# EAGLE schematic ActuatorBoard (EAGLE 9.6.2)
DESIGNER: Thomas Christison, James Smith; REV#: B; REVIEWER: ADCS Electrical

## Sheet 1 of 6
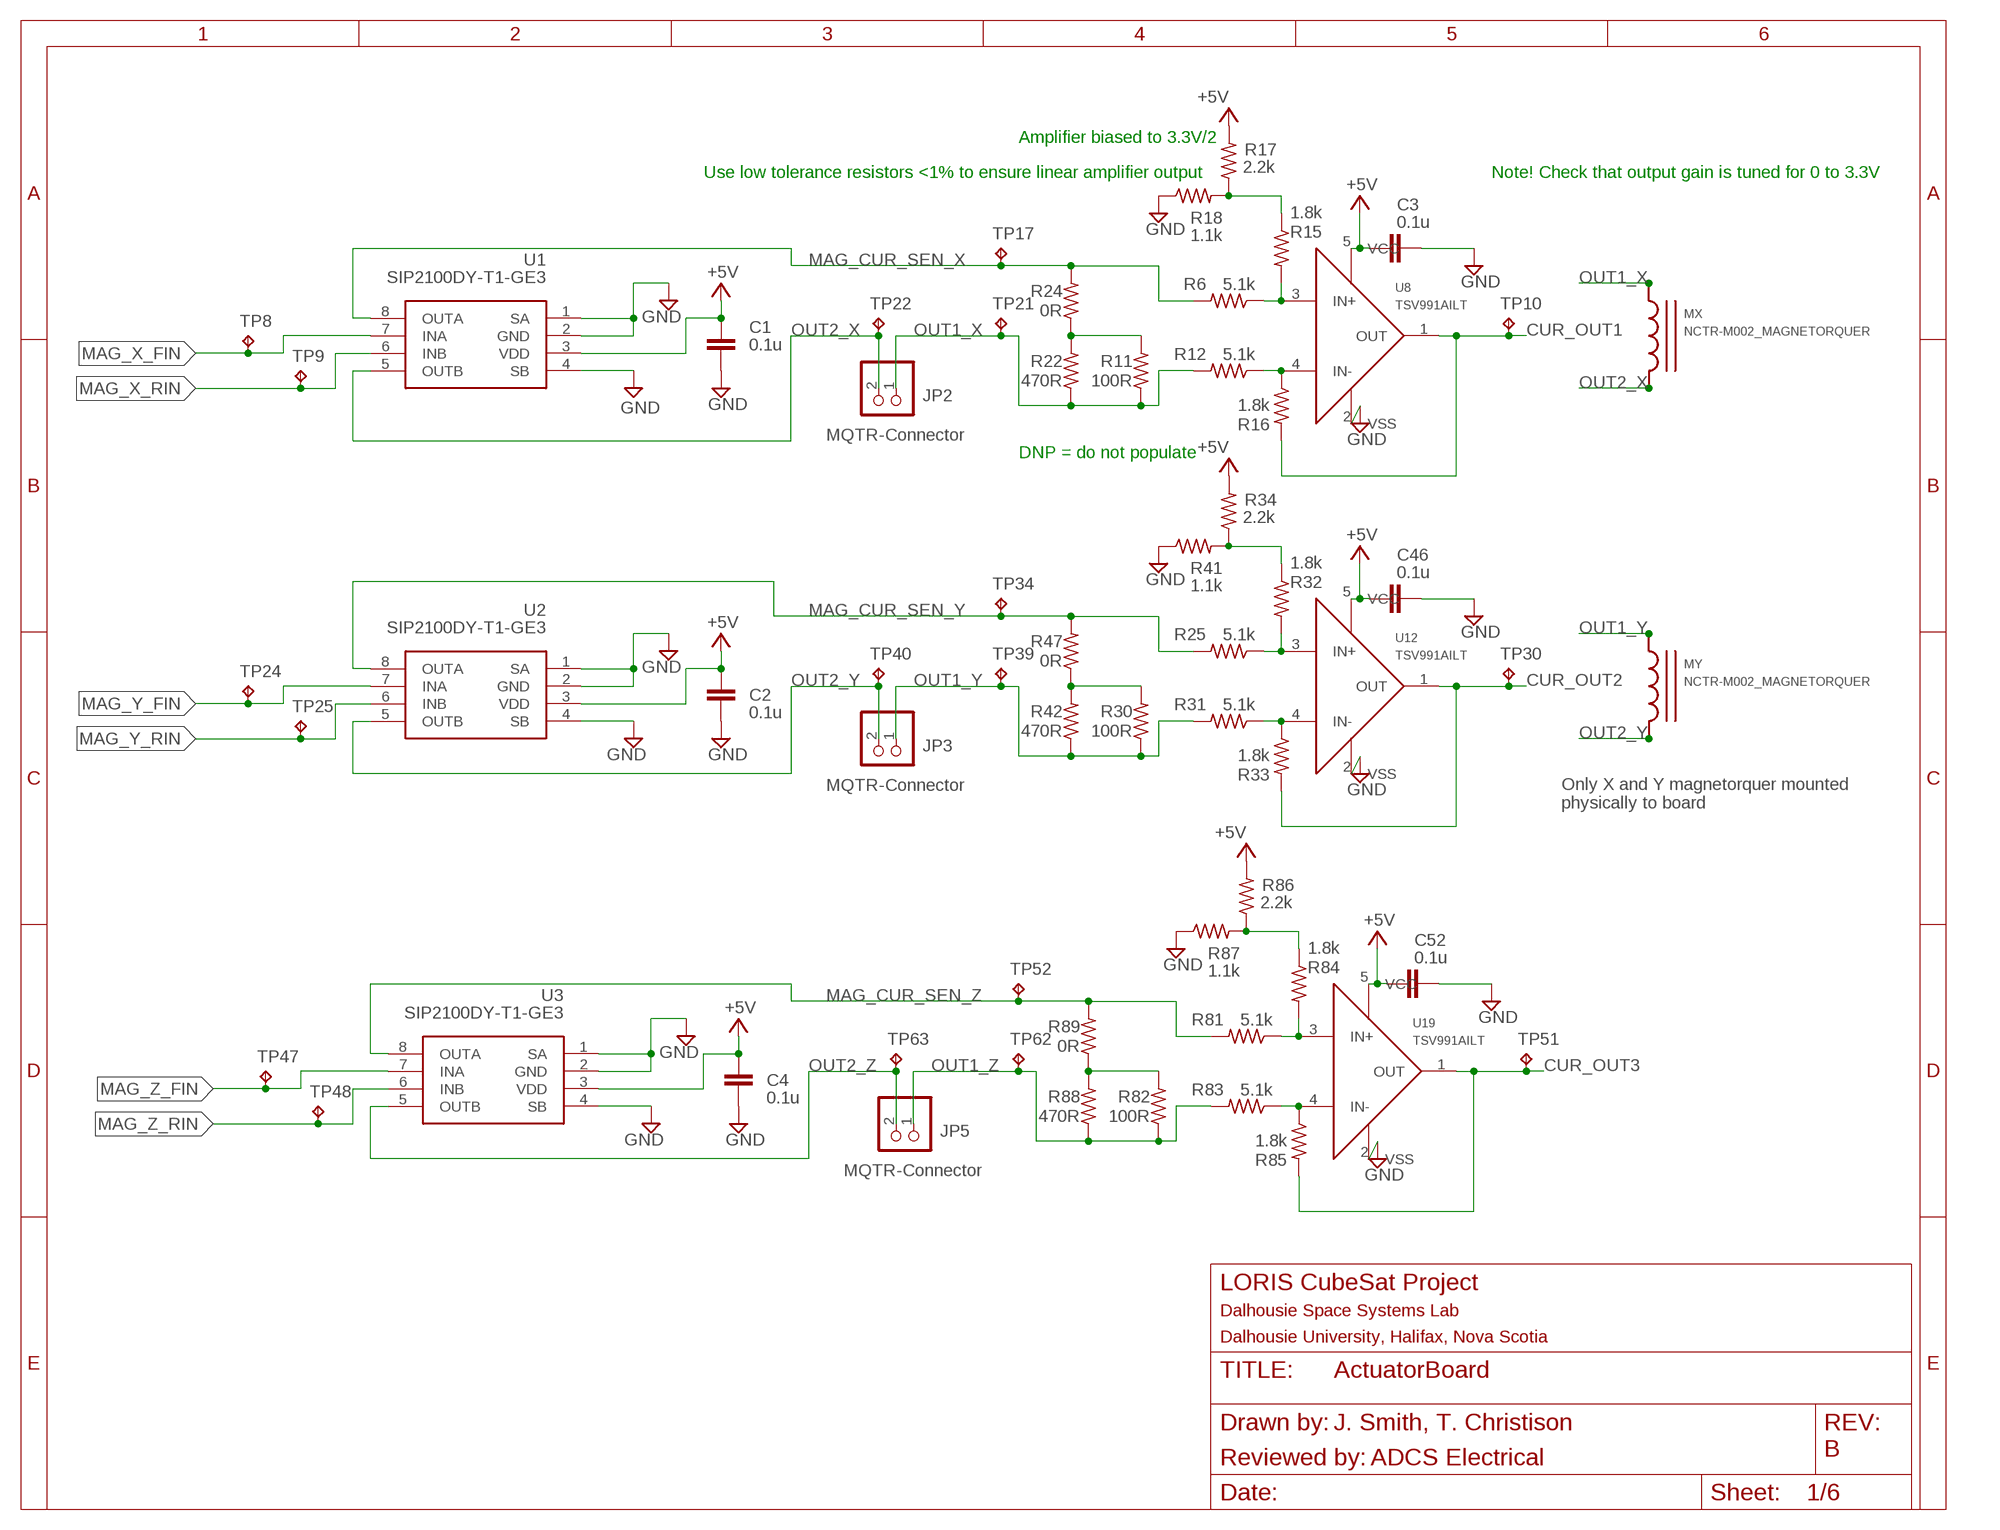
[diagram p0: schematic, sheet 1]

### Parts
C1  0.1u  C-EUC0603  [C0603]
C2  0.1u  C-EUC0603  [C0603]
C3  0.1u  C-EUC0402  [C0402]
C4  0.1u  C-EUC0603  [C0603]
C46  0.1u  C-EUC0402  [C0402]
C52  0.1u  C-EUC0402  [C0402]
JP2  PINHD-1X2  [1X02]
JP3  PINHD-1X2  [1X02]
JP5  PINHD-1X2  [1X02]
MX  NCTR-M002_MAGNETORQUER  [MAG_MOUNT_V3]
MY  NCTR-M002_MAGNETORQUER  [MAG_MOUNT_V3]
R6  5.1k  R-US_R0402  [R0402]
R11  100R  R-US_R0805  [R0805]
R12  5.1k  R-US_R0402  [R0402]
R15  1.8k  R-US_R0402  [R0402]
R16  1.8k  R-US_R0402  [R0402]
R17  2.2k  R-US_R0402  [R0402]
R18  1.1k  R-US_R0402  [R0402]
R22  470R  R-US_R0805  [R0805]
R24  0R  R-US_R0805  [R0805]
R25  5.1k  R-US_R0402  [R0402]
R30  100R  R-US_R0805  [R0805]
R31  5.1k  R-US_R0402  [R0402]
R32  1.8k  R-US_R0402  [R0402]
R33  1.8k  R-US_R0402  [R0402]
R34  2.2k  R-US_R0402  [R0402]
R41  1.1k  R-US_R0402  [R0402]
R42  470R  R-US_R0805  [R0805]
R47  0R  R-US_R0805  [R0805]
R81  5.1k  R-US_R0402  [R0402]
R82  100R  R-US_R0805  [R0805]
R83  5.1k  R-US_R0402  [R0402]
R84  1.8k  R-US_R0402  [R0402]
R85  1.8k  R-US_R0402  [R0402]
R86  2.2k  R-US_R0402  [R0402]
R87  1.1k  R-US_R0402  [R0402]
R88  470R  R-US_R0805  [R0805]
R89  0R  R-US_R0805  [R0805]
TP8  TESTPOINT  [TP_P76H50]
TP9  TESTPOINT  [TP_P76H50]
TP10  TESTPOINT  [TP_P76H50]
TP17  TESTPOINT  [TP_P76H50]
TP21  TESTPOINT  [TP_P76H50]
TP22  TESTPOINT  [TP_P76H50]
TP24  TESTPOINT  [TP_P76H50]
TP25  TESTPOINT  [TP_P76H50]
TP30  TESTPOINT  [TP_P76H50]
TP34  TESTPOINT  [TP_P76H50]
TP39  TESTPOINT  [TP_P76H50]
TP40  TESTPOINT  [TP_P76H50]
TP47  TESTPOINT  [TP_P76H50]
TP48  TESTPOINT  [TP_P76H50]
TP51  TESTPOINT  [TP_P76H50]
TP52  TESTPOINT  [TP_P76H50]
TP62  TESTPOINT  [TP_P76H50]
TP63  TESTPOINT  [TP_P76H50]
U1  SIP2100DY-T1-GE3  [SOIC8P127_490X600X175L71X43N_SIP2100DY-T1-GE3]
U2  SIP2100DY-T1-GE3  [SOIC8P127_490X600X175L71X43N_SIP2100DY-T1-GE3]
U3  SIP2100DY-T1-GE3  [SOIC8P127_490X600X175L71X43N_SIP2100DY-T1-GE3]
U8  TSV991AILT  [SOT95P280X145-5N]
U12  TSV991AILT  [SOT95P280X145-5N]
U19  TSV991AILT  [SOT95P280X145-5N]

### Nets
+5V: C1.1 C2.2 C3.1 C4.2 C46.1 C52.1 R17.2 R34.2 R86.2 U1.3(VDD) U2.3(VDD) U3.3(VDD) U8.5(VCC) U12.5(VCC) U19.5(VCC) ; also sheet 2,3,4,5
CUR_OUT1: R16.2 TP10.1(TP) U8.1(OUT) ; also sheet 2
CUR_OUT2: R33.2 TP30.1(TP) U12.1(OUT) ; also sheet 2
CUR_OUT3: R85.2 TP51.1(TP) U19.1(OUT) ; also sheet 2
GND: C1.2 C2.1 C3.2 C4.1 C46.2 C52.2 R18.1 R41.1 R87.1 U1.1(SA) U1.2(GND) U1.4(SB) U2.1(SA) U2.2(GND) U2.4(SB) U3.1(SA) U3.2(GND) U3.4(SB) U8.2(VSS) U12.2(VSS) U19.2(VSS) ; also sheet 2,3,4,5,6
MAG_CUR_SEN_X: R6.2 R24.2 TP17.1(TP) U1.8(OUTA)
MAG_CUR_SEN_Y: R25.2 R47.2 TP34.1(TP) U2.8(OUTA)
MAG_CUR_SEN_Z: R81.2 R89.2 TP52.1(TP) U3.8(OUTA)
MAG_X_FIN: TP8.1(TP) U1.7(INA) ; also sheet 2
MAG_X_RIN: TP9.1(TP) U1.6(INB) ; also sheet 2
MAG_Y_FIN: TP24.1(TP) U2.7(INA) ; also sheet 2
MAG_Y_RIN: TP25.1(TP) U2.6(INB) ; also sheet 2
MAG_Z_FIN: TP47.1(TP) U3.7(INA) ; also sheet 2
MAG_Z_RIN: TP48.1(TP) U3.6(INB) ; also sheet 2
N$6: R12.1 R16.1 U8.4(IN-)
N$8: R6.1 R15.2 U8.3(IN+)
N$9: R15.1 R17.1 R18.2
N$16: R11.2 R22.2 R24.1
N$17: R31.1 R33.1 U12.4(IN-)
N$20: R25.1 R32.2 U12.3(IN+)
N$21: R32.1 R34.1 R41.2
N$22: R30.2 R42.2 R47.1
N$48: R83.1 R85.1 U19.4(IN-)
N$53: R81.1 R84.2 U19.3(IN+)
N$54: R84.1 R86.1 R87.2
N$55: R82.2 R88.2 R89.1
OUT1_X: JP2.1 R11.1 R12.2 R22.1 TP21.1(TP)
OUT1_Y: JP3.1 R30.1 R31.2 R42.1 TP39.1(TP)
OUT1_Z: JP5.1 R82.1 R83.2 R88.1 TP62.1(TP)
OUT2_X: JP2.2 TP22.1(TP) U1.5(OUTB)
OUT2_Y: JP3.2 TP40.1(TP) U2.5(OUTB)
OUT2_Z: JP5.2 TP63.1(TP) U3.5(OUTB)

### Notes on the sheet
- Amplifier biased to 3.3V/2
- Use low tolerance resistors <1% to ensure linear amplifier output | Note! Check that output gain is tuned for 0 to 3.3V
- MQTR-Connector
- DNP = do not populate
- MQTR-Connector
- Only X and Y magnetorquer mounted
  physically to board
- MQTR-Connector
- J. Smith, T. Christison
- B
- ADCS Electrical

## Sheet 2 of 6
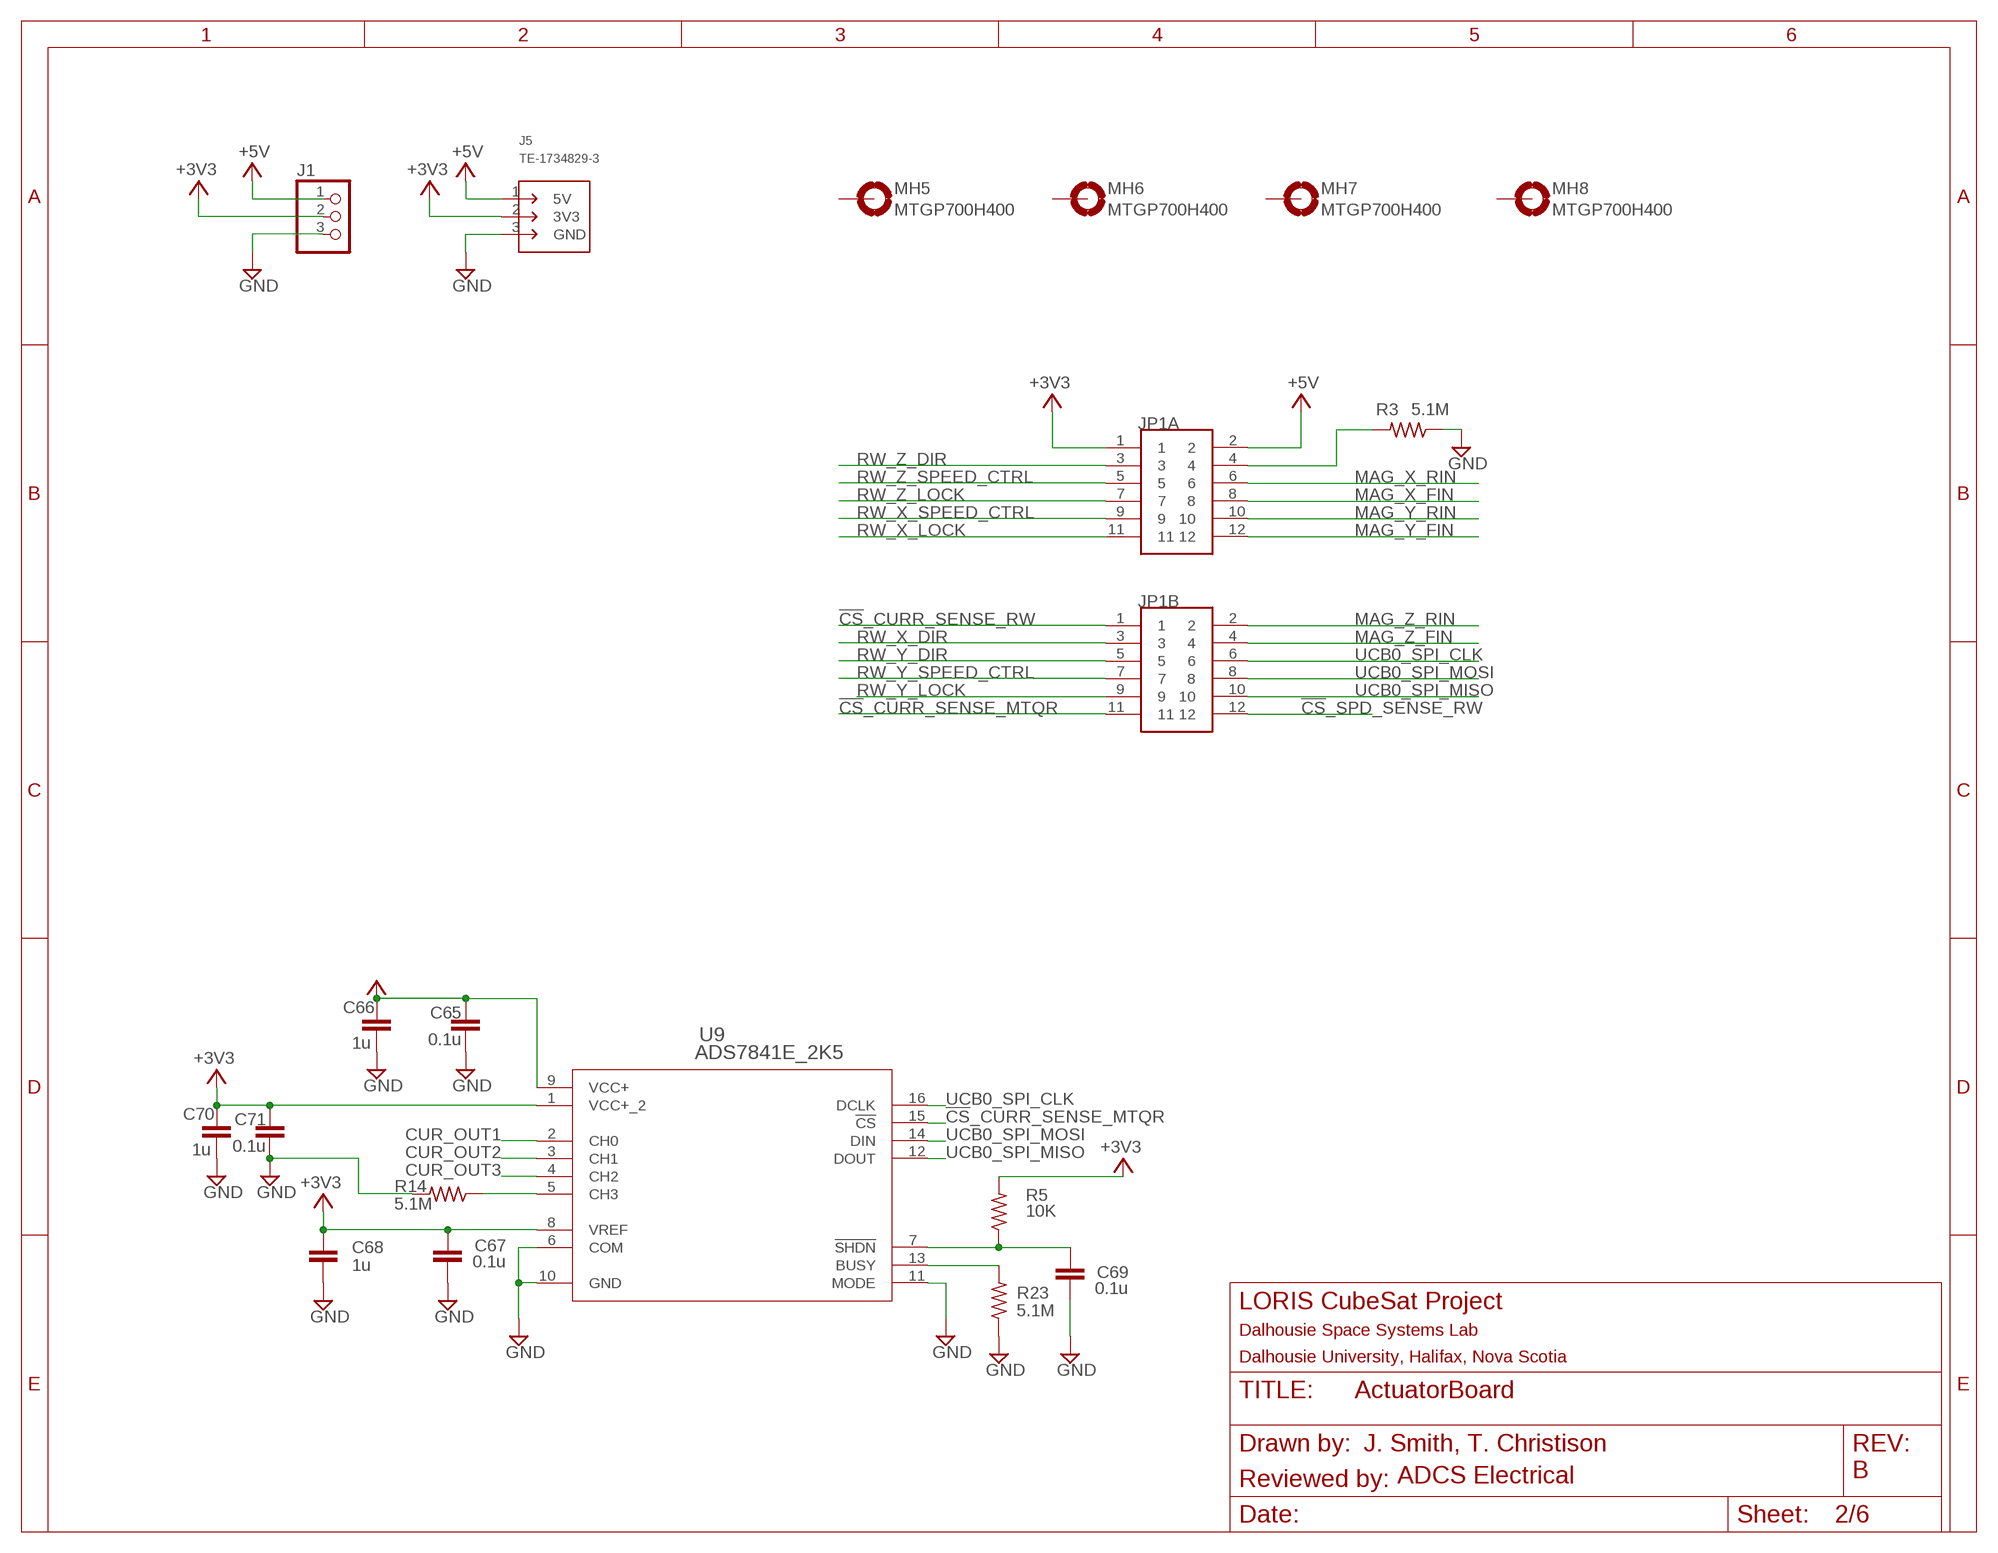
[diagram p1: schematic, sheet 2]

### Parts
C65  0.1u  C-EUC0402  [C0402]
C66  1u  C-EUC0402  [C0402]
C67  0.1u  C-EUC0402  [C0402]
C68  1u  C-EUC0402  [C0402]
C69  0.1u  C-EUC0402  [C0402]
C70  1u  C-EUC0402  [C0402]
C71  0.1u  C-EUC0402  [C0402]
J1  PINHD-1X3  [1X03]
J5  TE-1734829-3  [TE-1734829-3]
JP1A  832-10-012-10-005000  [832-10-012-10-005000]
JP1B  832-10-012-10-005000  [832-10-012-10-005000]
MH5  MTGP700H400  [MTGP700H400]
MH6  MTGP700H400  [MTGP700H400]
MH7  MTGP700H400  [MTGP700H400]
MH8  MTGP700H400  [MTGP700H400]
R3  5.1M  R-US_R0402  [R0402]
R5  10K  R-US_R0402  [R0402]
R14  5.1M  R-US_R0402  [R0402]
R23  5.1M  R-US_R0402  [R0402]
U9  ADS7841E_2K5  [DBQ16]

### Nets
!CS!_CURR_SENSE_MTQR: JP1B.11 U9.15(!CS)
!CS!_CURR_SENSE_RW: JP1B.1 ; also sheet 6
!CS!_SPD_SENSE_RW: JP1B.12 ; also sheet 6
+3V3: C65.1 C66.1 C67.1 C68.1 C70.1 C71.1 J1.2 J5.2(3V3) JP1A.1 R5.2 U9.1(VCC+_2) U9.8(VREF) U9.9(VCC+) ; also sheet 3,4,5,6
+5V: J1.1 J5.1(5V) JP1A.2 ; also sheet 1,3,4,5
CUR_OUT1: U9.2(CH0) ; also sheet 1
CUR_OUT2: U9.3(CH1) ; also sheet 1
CUR_OUT3: U9.4(CH2) ; also sheet 1
GND: C65.2 C66.2 C67.2 C68.2 C69.2 C70.2 C71.2 J1.3 J5.3(GND) R3.1 R14.2 R23.1 U9.6(COM) U9.10(GND) U9.11(MODE) ; also sheet 1,3,4,5,6
MAG_X_FIN: JP1A.8 ; also sheet 1
MAG_X_RIN: JP1A.6 ; also sheet 1
MAG_Y_FIN: JP1A.12 ; also sheet 1
MAG_Y_RIN: JP1A.10 ; also sheet 1
MAG_Z_FIN: JP1B.4 ; also sheet 1
MAG_Z_RIN: JP1B.2 ; also sheet 1
N$1: JP1A.4 R3.2
N$2: C69.1 R5.1 U9.7(!SHDN)
N$25: R23.2 U9.13(BUSY)
N$26: R14.1 U9.5(CH3)
RW_X_DIR: JP1B.3 ; also sheet 3
RW_X_LOCK: JP1A.11 ; also sheet 3
RW_X_SPEED_CTRL: JP1A.9 ; also sheet 3
RW_Y_DIR: JP1B.5 ; also sheet 4
RW_Y_LOCK: JP1B.9 ; also sheet 4
RW_Y_SPEED_CTRL: JP1B.7 ; also sheet 4
RW_Z_DIR: JP1A.3 ; also sheet 5
RW_Z_LOCK: JP1A.7 ; also sheet 5
RW_Z_SPEED_CTRL: JP1A.5 ; also sheet 5
UCB0_SPI_CLK: JP1B.6 U9.16(DCLK) ; also sheet 6
UCB0_SPI_MISO: JP1B.10 U9.12(DOUT) ; also sheet 6
UCB0_SPI_MOSI: JP1B.8 U9.14(DIN) ; also sheet 6
Unconnected: MH5.1(MOUNT) MH6.1(MOUNT) MH7.1(MOUNT) MH8.1(MOUNT)

### Notes on the sheet
- J. Smith, T. Christison
- ADCS Electrical | B

## Sheet 3 of 6
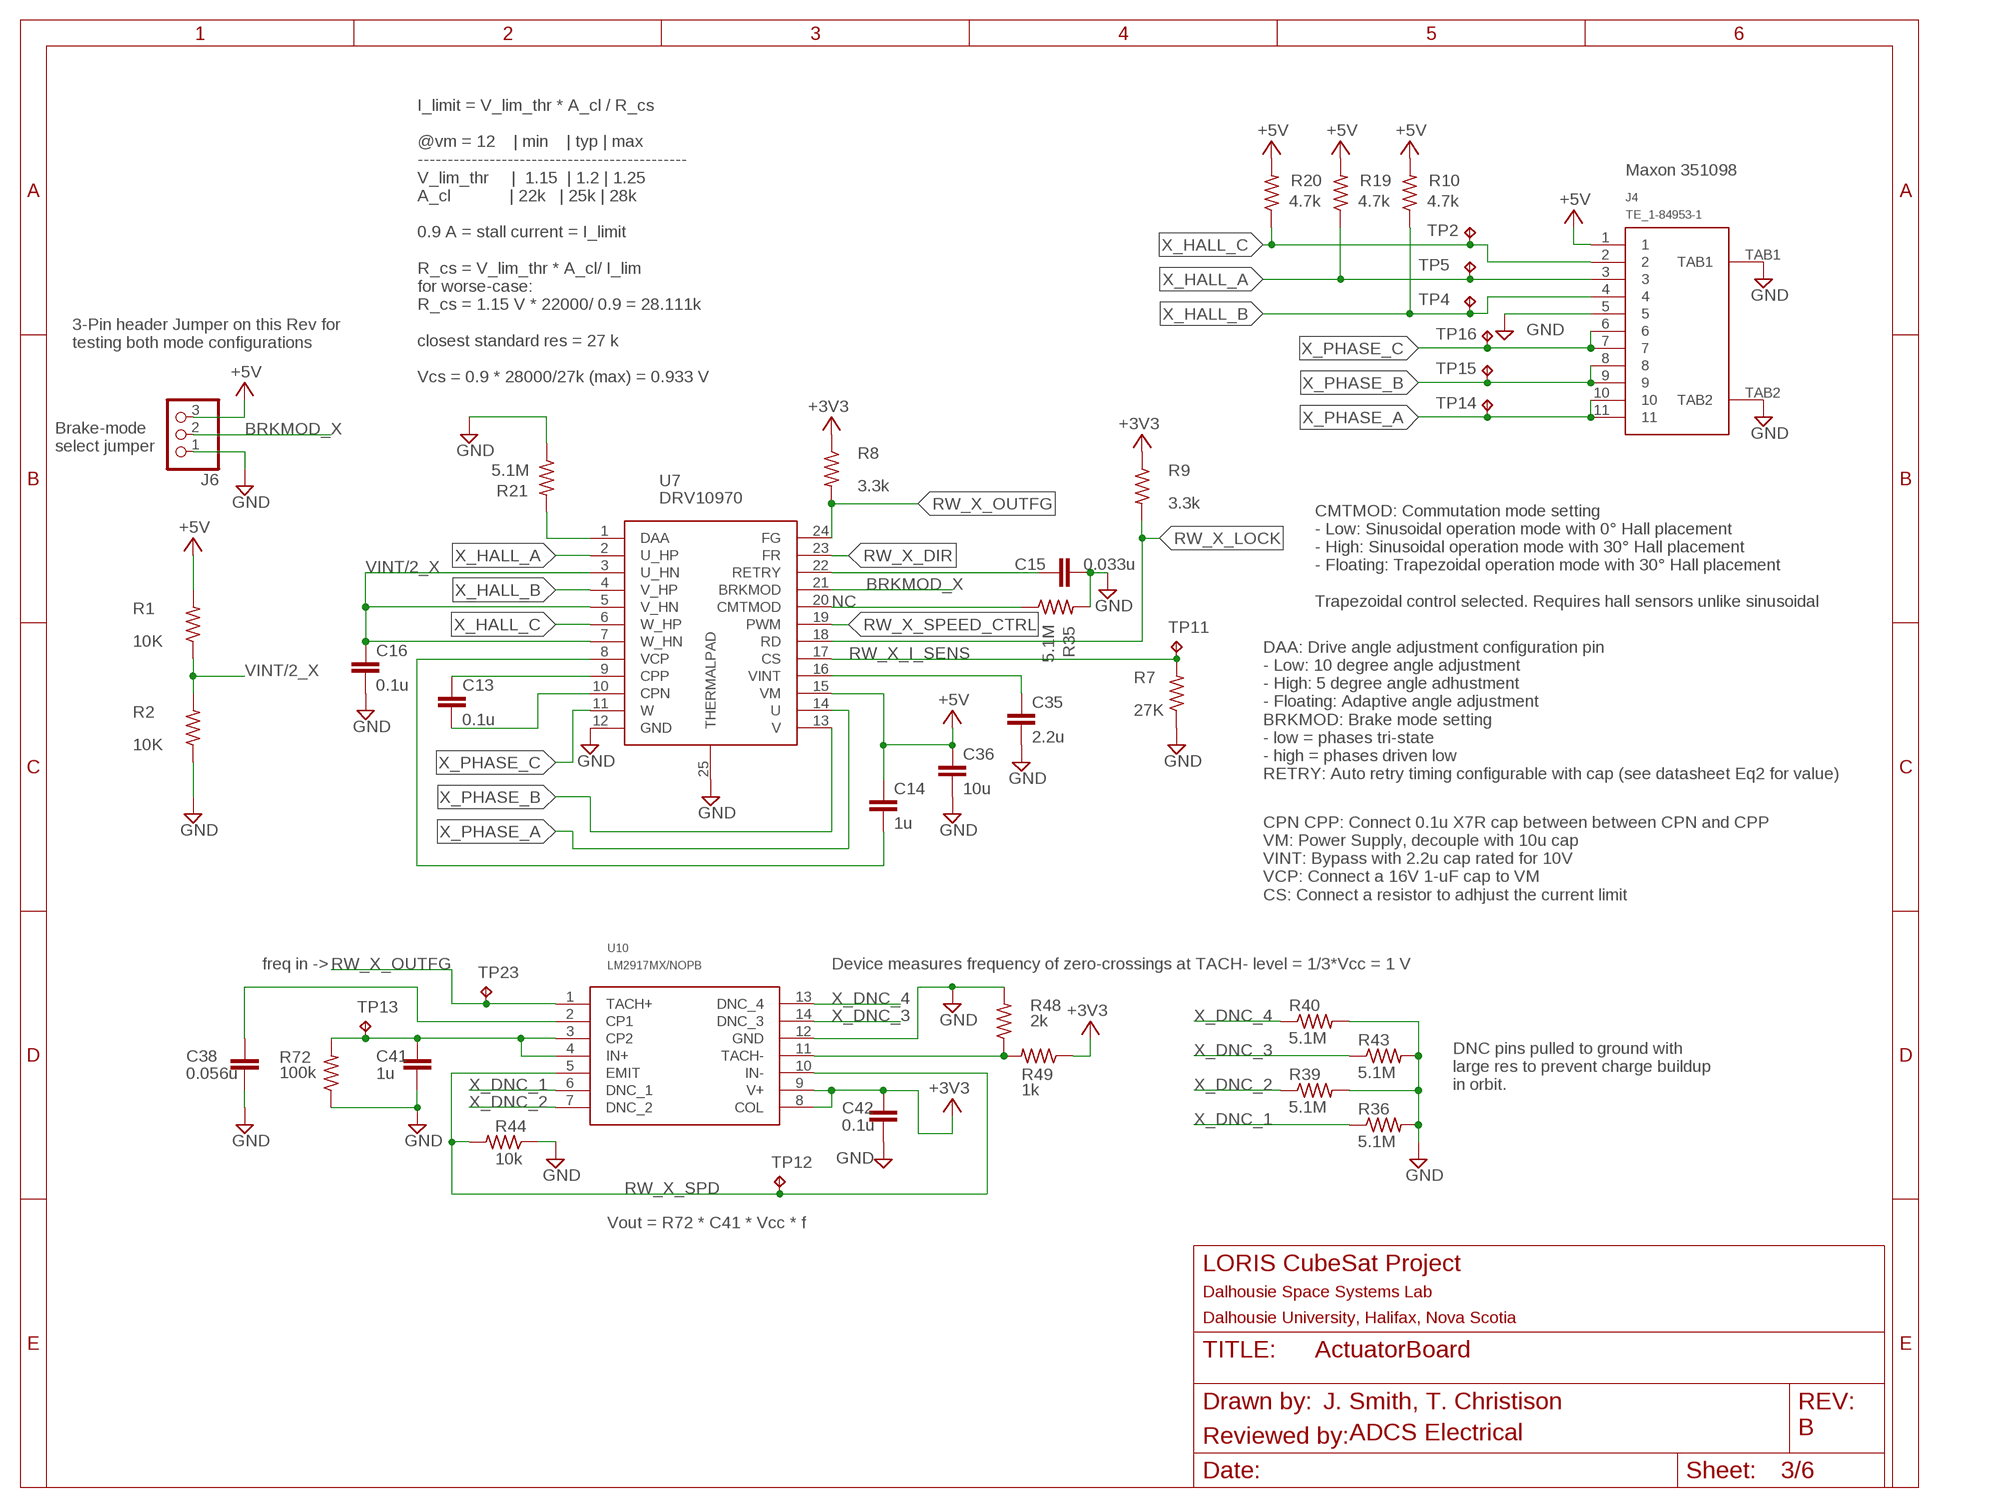
[diagram p2: schematic, sheet 3]

### Parts
C13  0.1u  C-EUC0603  [C0603]
C14  1u  C-EUC0603  [C0603]
C15  0.033u  C-EUC0603  [C0603]
C16  0.1u  C-EUC0603  [C0603]
C35  2.2u  C-EUC0603  [C0603]
C36  10u  C-EUC0603  [C0603]
C38  0.056u  C-EUC0603  [C0603]
C41  1u  C-EUC0603  [C0603]
C42  0.1u  C-EUC0603  [C0603]
J4  TE_1-84953-1  [TE_1-84953-1]
J6  PINHD-1X3  [1X03]
R1  10K  R-US_R0603  [R0603]
R2  10K  R-US_R0603  [R0603]
R7  27K  R-US_R0603  [R0603]
R8  3.3k  R-US_R0603  [R0603]
R9  3.3k  R-US_R0603  [R0603]
R10  4.7k  R-US_R0402  [R0402]
R19  4.7k  R-US_R0402  [R0402]
R20  4.7k  R-US_R0402  [R0402]
R21  5.1M  R-US_R0402  [R0402]
R35  5.1M  R-US_R0402  [R0402]
R36  5.1M  R-US_R0402  [R0402]
R39  5.1M  R-US_R0402  [R0402]
R40  5.1M  R-US_R0402  [R0402]
R43  5.1M  R-US_R0402  [R0402]
R44  10k  R-US_R0603  [R0603]
R48  2k  R-US_R0603  [R0603]
R49  1k  R-US_R0603  [R0603]
R72  100k  R-US_R0603  [R0603]
TP2  TESTPOINT  [TP_P76H50]
TP4  TESTPOINT  [TP_P76H50]
TP5  TESTPOINT  [TP_P76H50]
TP11  TESTPOINT  [TP_P76H50]
TP12  TESTPOINT  [TP_P76H50]
TP13  TESTPOINT  [TP_P76H50]
TP14  TESTPOINT  [TP_P76H50]
TP15  TESTPOINT  [TP_P76H50]
TP16  TESTPOINT  [TP_P76H50]
TP23  TESTPOINT  [TP_P76H50]
U7  DRV10970_MOTOR_DRIVERDRV10970  [SOP65P640X120-25T240X328N]
U10  LM2917MX/NOPB  [SOIC14P127_865X600X175L83X41N_LM2917MX-NOPB]

### Nets
+3V3: C42.2 R8.1 R9.1 R49.1 U10.8(COL) U10.9(V+) ; also sheet 2,4,5,6
+5V: C14.1 C36.1 J4.1 J6.3 R1.2 R10.2 R19.2 R20.2 U7.15(VM) ; also sheet 1,2,4,5
BRKMOD_X: J6.2 U7.21(BRKMOD)
GND: C15.2 C16.2 C35.2 C36.2 C38.1 C41.1 C42.1 J4.5 J4.TAB1 J4.TAB2 J6.1 R2.1 R7.1 R21.1 R35.2 R36.2 R39.2 R40.2 R43.2 R44.1 R48.2 R72.1 U7.12(GND) U7.25(THERMALPAD) U10.12(GND) ; also sheet 1,2,4,5,6
N$3: C13.1 U7.9(CPP)
N$19: C14.2 U7.8(VCP)
N$23: C13.2 U7.10(CPN)
N$24: C35.1 U7.16(VINT)
N$27: C15.1 U7.22(RETRY)
N$28: R21.2 U7.1(DAA)
N$29: R35.1 U7.20(CMTMOD)
N$30: C41.2 R72.2 TP13.1(TP) U10.3(CP2) U10.4(IN+)
N$31: R48.1 R49.2 U10.11(TACH-)
N$52: C38.2 U10.2(CP1)
RW_X_DIR: U7.23(FR) ; also sheet 2
RW_X_I_SENS: R7.2 TP11.1(TP) U7.17(CS) ; also sheet 6
RW_X_LOCK: R9.2 U7.18(RD) ; also sheet 2
RW_X_OUTFG: R8.2 TP23.1(TP) U7.24(FG) U10.1(TACH+)
RW_X_SPD: R44.2 TP12.1(TP) U10.5(EMIT) U10.10(IN-) ; also sheet 6
RW_X_SPEED_CTRL: U7.19(PWM) ; also sheet 2
VINT/2_X: C16.1 R1.1 R2.2 U7.3(U_HN) U7.5(V_HN) U7.7(W_HN)
X_DNC_1: R36.1 U10.6(DNC_1)
X_DNC_2: R39.1 U10.7(DNC_2)
X_DNC_3: R43.1 U10.14(DNC_3)
X_DNC_4: R40.1 U10.13(DNC_4)
X_HALL_A: J4.3 R19.1 TP5.1(TP) U7.2(U_HP)
X_HALL_B: J4.4 R10.1 TP4.1(TP) U7.4(V_HP)
X_HALL_C: J4.2 R20.1 TP2.1(TP) U7.6(W_HP)
X_PHASE_A: J4.10 J4.11 TP14.1(TP) U7.14(U)
X_PHASE_B: J4.8 J4.9 TP15.1(TP) U7.13(V)
X_PHASE_C: J4.6 J4.7 TP16.1(TP) U7.11(W)

### Notes on the sheet
- Maxon 351098
- 3-Pin header Jumper on this Rev for 
  testing both mode configurations
- I_limit = V_lim_thr * A_cl / R_cs
  
  @vm = 12    | min    | typ | max
  ---------------------------------------------
  V_lim_thr     |  1.15  | 1.2 | 1.25
  A_cl             | 22k   | 25k | 28k
  
  0.9 A = stall current = I_limit
  
  R_cs = V_lim_thr * A_cl/ I_lim
  for worse-case: 
  R_cs = 1.15 V * 22000/ 0.9 = 28.111k
  
  closest standard res = 27 k
  
  Vcs = 0.9 * 28000/27k (max) = 0.933 V
- Brake-mode
  select jumper
- NC
- CMTMOD: Commutation mode setting
  - Low: Sinusoidal operation mode with 0° Hall placement 
  - High: Sinusoidal operation mode with 30° Hall placement 
  - Floating: Trapezoidal operation mode with 30° Hall placement
  
  Trapezoidal control selected. Requires hall sensors unlike sinusoidal
- DAA: Drive angle adjustment configuration pin
  - Low: 10 degree angle adjustment
  - High: 5 degree angle adhustment
  - Floating: Adaptive angle adjustment
  BRKMOD: Brake mode setting
  - low = phases tri-state
  - high = phases driven low
  RETRY: Auto retry timing configurable with cap (see datasheet Eq2 for value)
- CPN CPP: Connect 0.1u X7R cap between between CPN and CPP
  VM: Power Supply, decouple with 10u cap
  VINT: Bypass with 2.2u cap rated for 10V
  VCP: Connect a 16V 1-uF cap to VM
  CS: Connect a resistor to adhjust the current limit
- freq in -> | Device measures frequency of zero-crossings at TACH- level = 1/3*Vcc = 1 V
- DNC pins pulled to ground with 
  large res to prevent charge buildup 
  in orbit.
- Vout = R72 * C41 * Vcc * f
- J. Smith, T. Christison
- ADCS Electrical | B

## Sheet 4 of 6
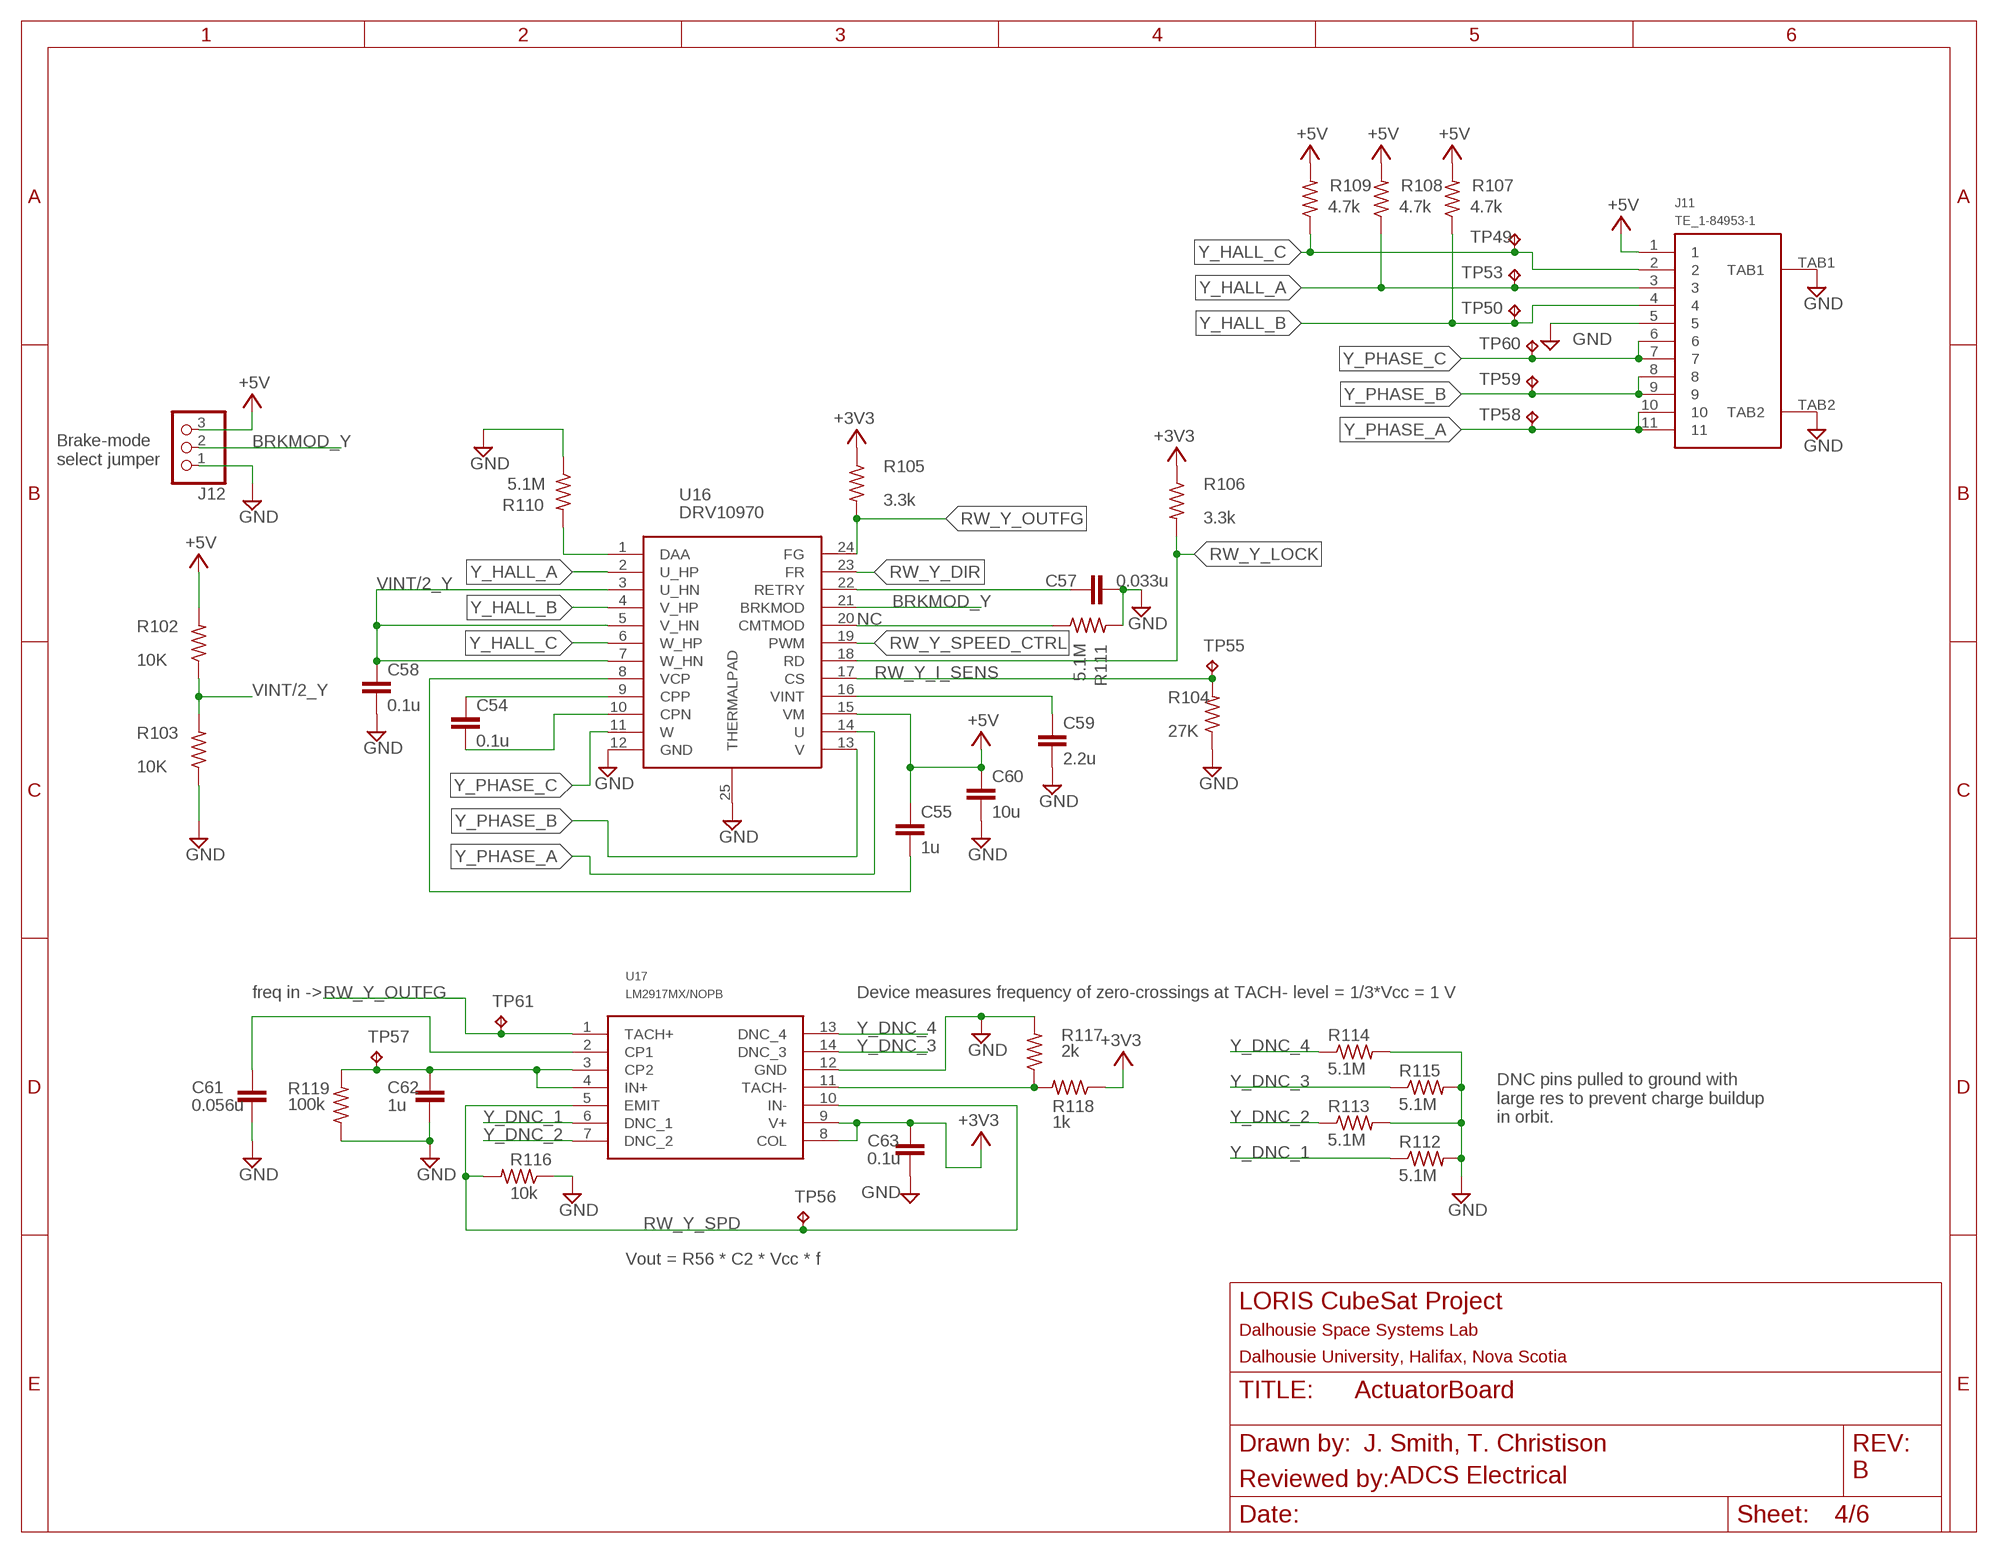
[diagram p3: schematic, sheet 4]

### Parts
C54  0.1u  C-EUC0603  [C0603]
C55  1u  C-EUC0603  [C0603]
C57  0.033u  C-EUC0603  [C0603]
C58  0.1u  C-EUC0603  [C0603]
C59  2.2u  C-EUC0603  [C0603]
C60  10u  C-EUC0603  [C0603]
C61  0.056u  C-EUC0603  [C0603]
C62  1u  C-EUC0603  [C0603]
C63  0.1u  C-EUC0603  [C0603]
J11  TE_1-84953-1  [TE_1-84953-1]
J12  PINHD-1X3  [1X03]
R102  10K  R-US_R0603  [R0603]
R103  10K  R-US_R0603  [R0603]
R104  27K  R-US_R0603  [R0603]
R105  3.3k  R-US_R0603  [R0603]
R106  3.3k  R-US_R0603  [R0603]
R107  4.7k  R-US_R0402  [R0402]
R108  4.7k  R-US_R0402  [R0402]
R109  4.7k  R-US_R0402  [R0402]
R110  5.1M  R-US_R0402  [R0402]
R111  5.1M  R-US_R0402  [R0402]
R112  5.1M  R-US_R0402  [R0402]
R113  5.1M  R-US_R0402  [R0402]
R114  5.1M  R-US_R0402  [R0402]
R115  5.1M  R-US_R0402  [R0402]
R116  10k  R-US_R0603  [R0603]
R117  2k  R-US_R0603  [R0603]
R118  1k  R-US_R0603  [R0603]
R119  100k  R-US_R0603  [R0603]
TP49  TESTPOINT  [TP_P76H50]
TP50  TESTPOINT  [TP_P76H50]
TP53  TESTPOINT  [TP_P76H50]
TP55  TESTPOINT  [TP_P76H50]
TP56  TESTPOINT  [TP_P76H50]
TP57  TESTPOINT  [TP_P76H50]
TP58  TESTPOINT  [TP_P76H50]
TP59  TESTPOINT  [TP_P76H50]
TP60  TESTPOINT  [TP_P76H50]
TP61  TESTPOINT  [TP_P76H50]
U16  DRV10970_MOTOR_DRIVERDRV10970  [SOP65P640X120-25T240X328N]
U17  LM2917MX/NOPB  [SOIC14P127_865X600X175L83X41N_LM2917MX-NOPB]

### Nets
+3V3: C63.2 R105.1 R106.1 R118.1 U17.8(COL) U17.9(V+) ; also sheet 2,3,5,6
+5V: C55.1 C60.1 J11.1 J12.3 R102.2 R107.2 R108.2 R109.2 U16.15(VM) ; also sheet 1,2,3,5
BRKMOD_Y: J12.2 U16.21(BRKMOD)
GND: C57.2 C58.2 C59.2 C60.2 C61.1 C62.1 C63.1 J11.5 J11.TAB1 J11.TAB2 J12.1 R103.1 R104.1 R110.1 R111.2 R112.2 R113.2 R114.2 R115.2 R116.1 R117.2 R119.1 U16.12(GND) U16.25(THERMALPAD) U17.12(GND) ; also sheet 1,2,3,5,6
N$63: C54.1 U16.9(CPP)
N$64: C55.2 U16.8(VCP)
N$65: C54.2 U16.10(CPN)
N$66: C59.1 U16.16(VINT)
N$68: C57.1 U16.22(RETRY)
N$69: R110.2 U16.1(DAA)
N$70: R111.1 U16.20(CMTMOD)
N$71: C62.2 R119.2 TP57.1(TP) U17.3(CP2) U17.4(IN+)
N$72: R117.1 R118.2 U17.11(TACH-)
N$73: C61.2 U17.2(CP1)
RW_Y_DIR: U16.23(FR) ; also sheet 2
RW_Y_I_SENS: R104.2 TP55.1(TP) U16.17(CS) ; also sheet 6
RW_Y_LOCK: R106.2 U16.18(RD) ; also sheet 2
RW_Y_OUTFG: R105.2 TP61.1(TP) U16.24(FG) U17.1(TACH+)
RW_Y_SPD: R116.2 TP56.1(TP) U17.5(EMIT) U17.10(IN-) ; also sheet 6
RW_Y_SPEED_CTRL: U16.19(PWM) ; also sheet 2
VINT/2_Y: C58.1 R102.1 R103.2 U16.3(U_HN) U16.5(V_HN) U16.7(W_HN)
Y_DNC_1: R112.1 U17.6(DNC_1)
Y_DNC_2: R113.1 U17.7(DNC_2)
Y_DNC_3: R115.1 U17.14(DNC_3)
Y_DNC_4: R114.1 U17.13(DNC_4)
Y_HALL_A: J11.3 R108.1 TP53.1(TP) U16.2(U_HP)
Y_HALL_B: J11.4 R107.1 TP50.1(TP) U16.4(V_HP)
Y_HALL_C: J11.2 R109.1 TP49.1(TP) U16.6(W_HP)
Y_PHASE_A: J11.10 J11.11 TP58.1(TP) U16.14(U)
Y_PHASE_B: J11.8 J11.9 TP59.1(TP) U16.13(V)
Y_PHASE_C: J11.6 J11.7 TP60.1(TP) U16.11(W)

### Notes on the sheet
- Brake-mode
  select jumper
- NC
- freq in -> | Device measures frequency of zero-crossings at TACH- level = 1/3*Vcc = 1 V
- DNC pins pulled to ground with 
  large res to prevent charge buildup 
  in orbit.
- Vout = R56 * C2 * Vcc * f
- J. Smith, T. Christison
- ADCS Electrical | B

## Sheet 5 of 6
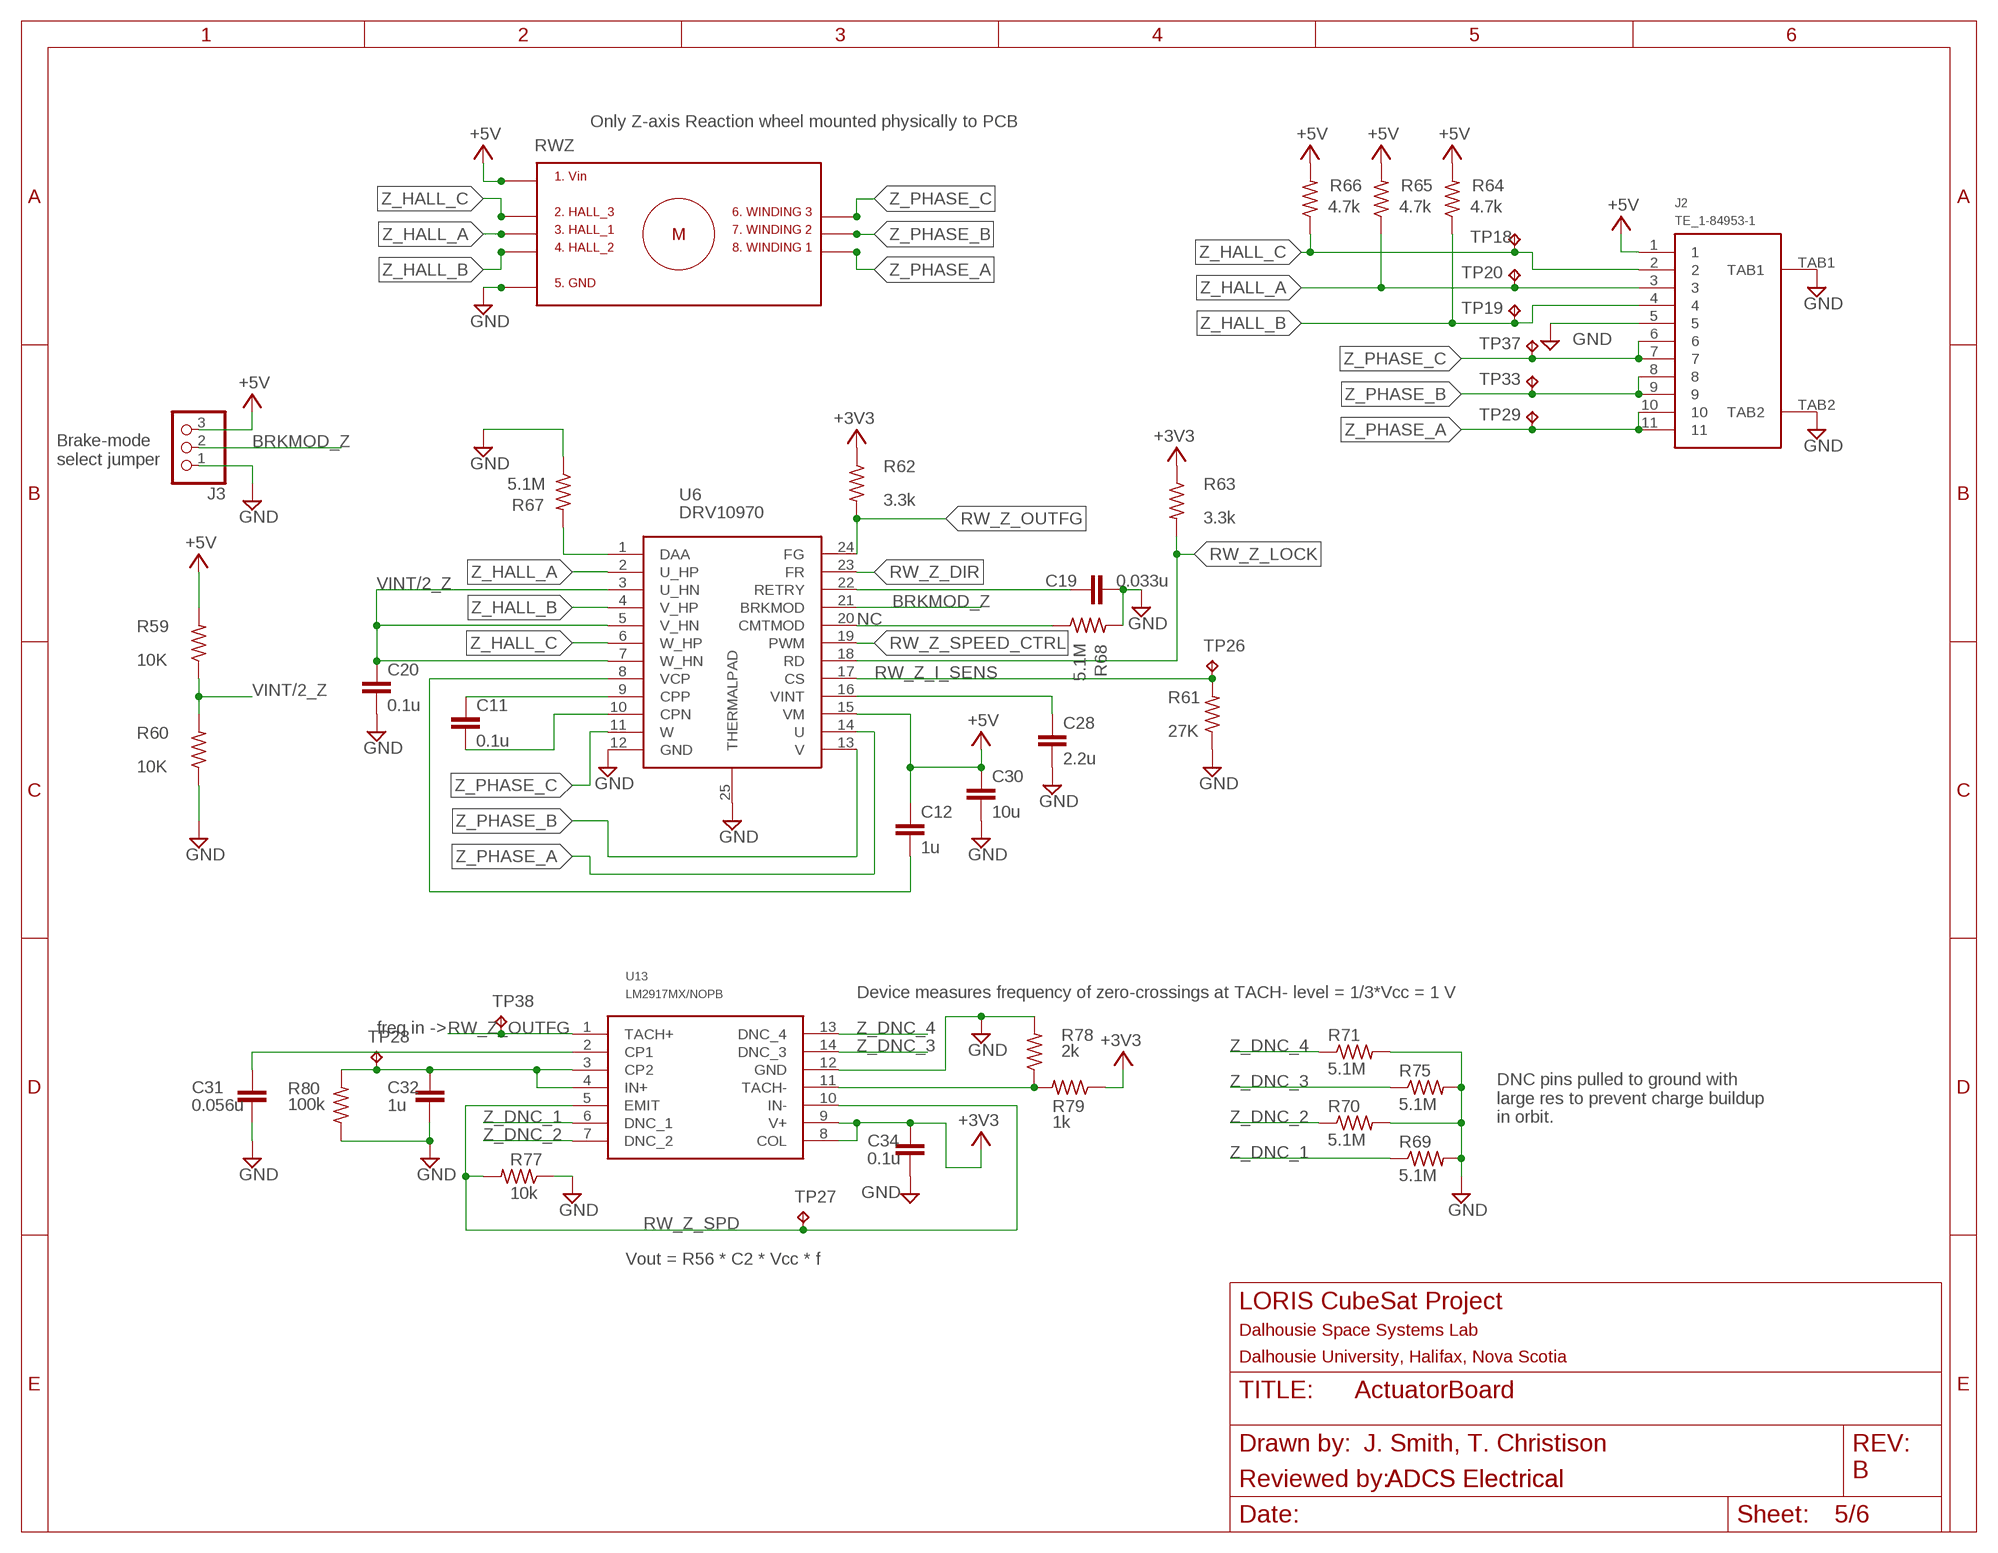
[diagram p4: schematic, sheet 5]

### Parts
C11  0.1u  C-EUC0603  [C0603]
C12  1u  C-EUC0603  [C0603]
C19  0.033u  C-EUC0603  [C0603]
C20  0.1u  C-EUC0603  [C0603]
C28  2.2u  C-EUC0603  [C0603]
C30  10u  C-EUC0603  [C0603]
C31  0.056u  C-EUC0603  [C0603]
C32  1u  C-EUC0603  [C0603]
C34  0.1u  C-EUC0603  [C0603]
J2  TE_1-84953-1  [TE_1-84953-1]
J3  PINHD-1X3  [1X03]
R59  10K  R-US_R0603  [R0603]
R60  10K  R-US_R0603  [R0603]
R61  27K  R-US_R0603  [R0603]
R62  3.3k  R-US_R0603  [R0603]
R63  3.3k  R-US_R0603  [R0603]
R64  4.7k  R-US_R0402  [R0402]
R65  4.7k  R-US_R0402  [R0402]
R66  4.7k  R-US_R0402  [R0402]
R67  5.1M  R-US_R0402  [R0402]
R68  5.1M  R-US_R0402  [R0402]
R69  5.1M  R-US_R0402  [R0402]
R70  5.1M  R-US_R0402  [R0402]
R71  5.1M  R-US_R0402  [R0402]
R75  5.1M  R-US_R0402  [R0402]
R77  10k  R-US_R0603  [R0603]
R78  2k  R-US_R0603  [R0603]
R79  1k  R-US_R0603  [R0603]
R80  100k  R-US_R0603  [R0603]
RWZ  REACTION_WHEEL_NOPINS_MAXON  [RWA_NOPINS]
TP18  TESTPOINT  [TP_P76H50]
TP19  TESTPOINT  [TP_P76H50]
TP20  TESTPOINT  [TP_P76H50]
TP26  TESTPOINT  [TP_P76H50]
TP27  TESTPOINT  [TP_P76H50]
TP28  TESTPOINT  [TP_P76H50]
TP29  TESTPOINT  [TP_P76H50]
TP33  TESTPOINT  [TP_P76H50]
TP37  TESTPOINT  [TP_P76H50]
TP38  TESTPOINT  [TP_P76H50]
U6  DRV10970_MOTOR_DRIVERDRV10970  [SOP65P640X120-25T240X328N]
U13  LM2917MX/NOPB  [SOIC14P127_865X600X175L83X41N_LM2917MX-NOPB]

### Nets
+3V3: C34.2 R62.1 R63.1 R79.1 U13.8(COL) U13.9(V+) ; also sheet 2,3,4,6
+5V: C12.1 C30.1 J2.1 J3.3 R59.2 R64.2 R65.2 R66.2 U6.15(VM) ; also sheet 1,2,3,4
BRKMOD_Z: J3.2 U6.21(BRKMOD)
GND: C19.2 C20.2 C28.2 C30.2 C31.1 C32.1 C34.1 J2.5 J2.TAB1 J2.TAB2 J3.1 R60.1 R61.1 R67.1 R68.2 R69.2 R70.2 R71.2 R75.2 R77.1 R78.2 R80.1 U6.12(GND) U6.25(THERMALPAD) U13.12(GND) ; also sheet 1,2,3,4,6
N$36: C11.1 U6.9(CPP)
N$38: C12.2 U6.8(VCP)
N$39: C11.2 U6.10(CPN)
N$40: C28.1 U6.16(VINT)
N$41: C19.1 U6.22(RETRY)
N$43: R67.2 U6.1(DAA)
N$44: R68.1 U6.20(CMTMOD)
N$49: C32.2 R80.2 TP28.1(TP) U13.3(CP2) U13.4(IN+)
N$50: R78.1 R79.2 U13.11(TACH-)
N$51: C31.2 U13.2(CP1)
RW_Z_DIR: U6.23(FR) ; also sheet 2
RW_Z_I_SENS: R61.2 TP26.1(TP) U6.17(CS) ; also sheet 6
RW_Z_LOCK: R63.2 U6.18(RD) ; also sheet 2
RW_Z_OUTFG: R62.2 TP38.1(TP) U6.24(FG) U13.1(TACH+)
RW_Z_SPD: R77.2 TP27.1(TP) U13.5(EMIT) U13.10(IN-) ; also sheet 6
RW_Z_SPEED_CTRL: U6.19(PWM) ; also sheet 2
VINT/2_Z: C20.1 R59.1 R60.2 U6.3(U_HN) U6.5(V_HN) U6.7(W_HN)
Z_DNC_1: R69.1 U13.6(DNC_1)
Z_DNC_2: R70.1 U13.7(DNC_2)
Z_DNC_3: R75.1 U13.14(DNC_3)
Z_DNC_4: R71.1 U13.13(DNC_4)
Z_HALL_A: J2.3 R65.1 TP20.1(TP) U6.2(U_HP)
Z_HALL_B: J2.4 R64.1 TP19.1(TP) U6.4(V_HP)
Z_HALL_C: J2.2 R66.1 TP18.1(TP) U6.6(W_HP)
Z_PHASE_A: J2.10 J2.11 TP29.1(TP) U6.14(U)
Z_PHASE_B: J2.8 J2.9 TP33.1(TP) U6.13(V)
Z_PHASE_C: J2.6 J2.7 TP37.1(TP) U6.11(W)

### Notes on the sheet
- Only Z-axis Reaction wheel mounted physically to PCB
- Brake-mode
  select jumper
- NC
- Device measures frequency of zero-crossings at TACH- level = 1/3*Vcc = 1 V
- freq in ->
- DNC pins pulled to ground with 
  large res to prevent charge buildup 
  in orbit.
- Vout = R56 * C2 * Vcc * f
- J. Smith, T. Christison
- B
- ADCS Electrical | ADCS Electrical

## Sheet 6 of 6
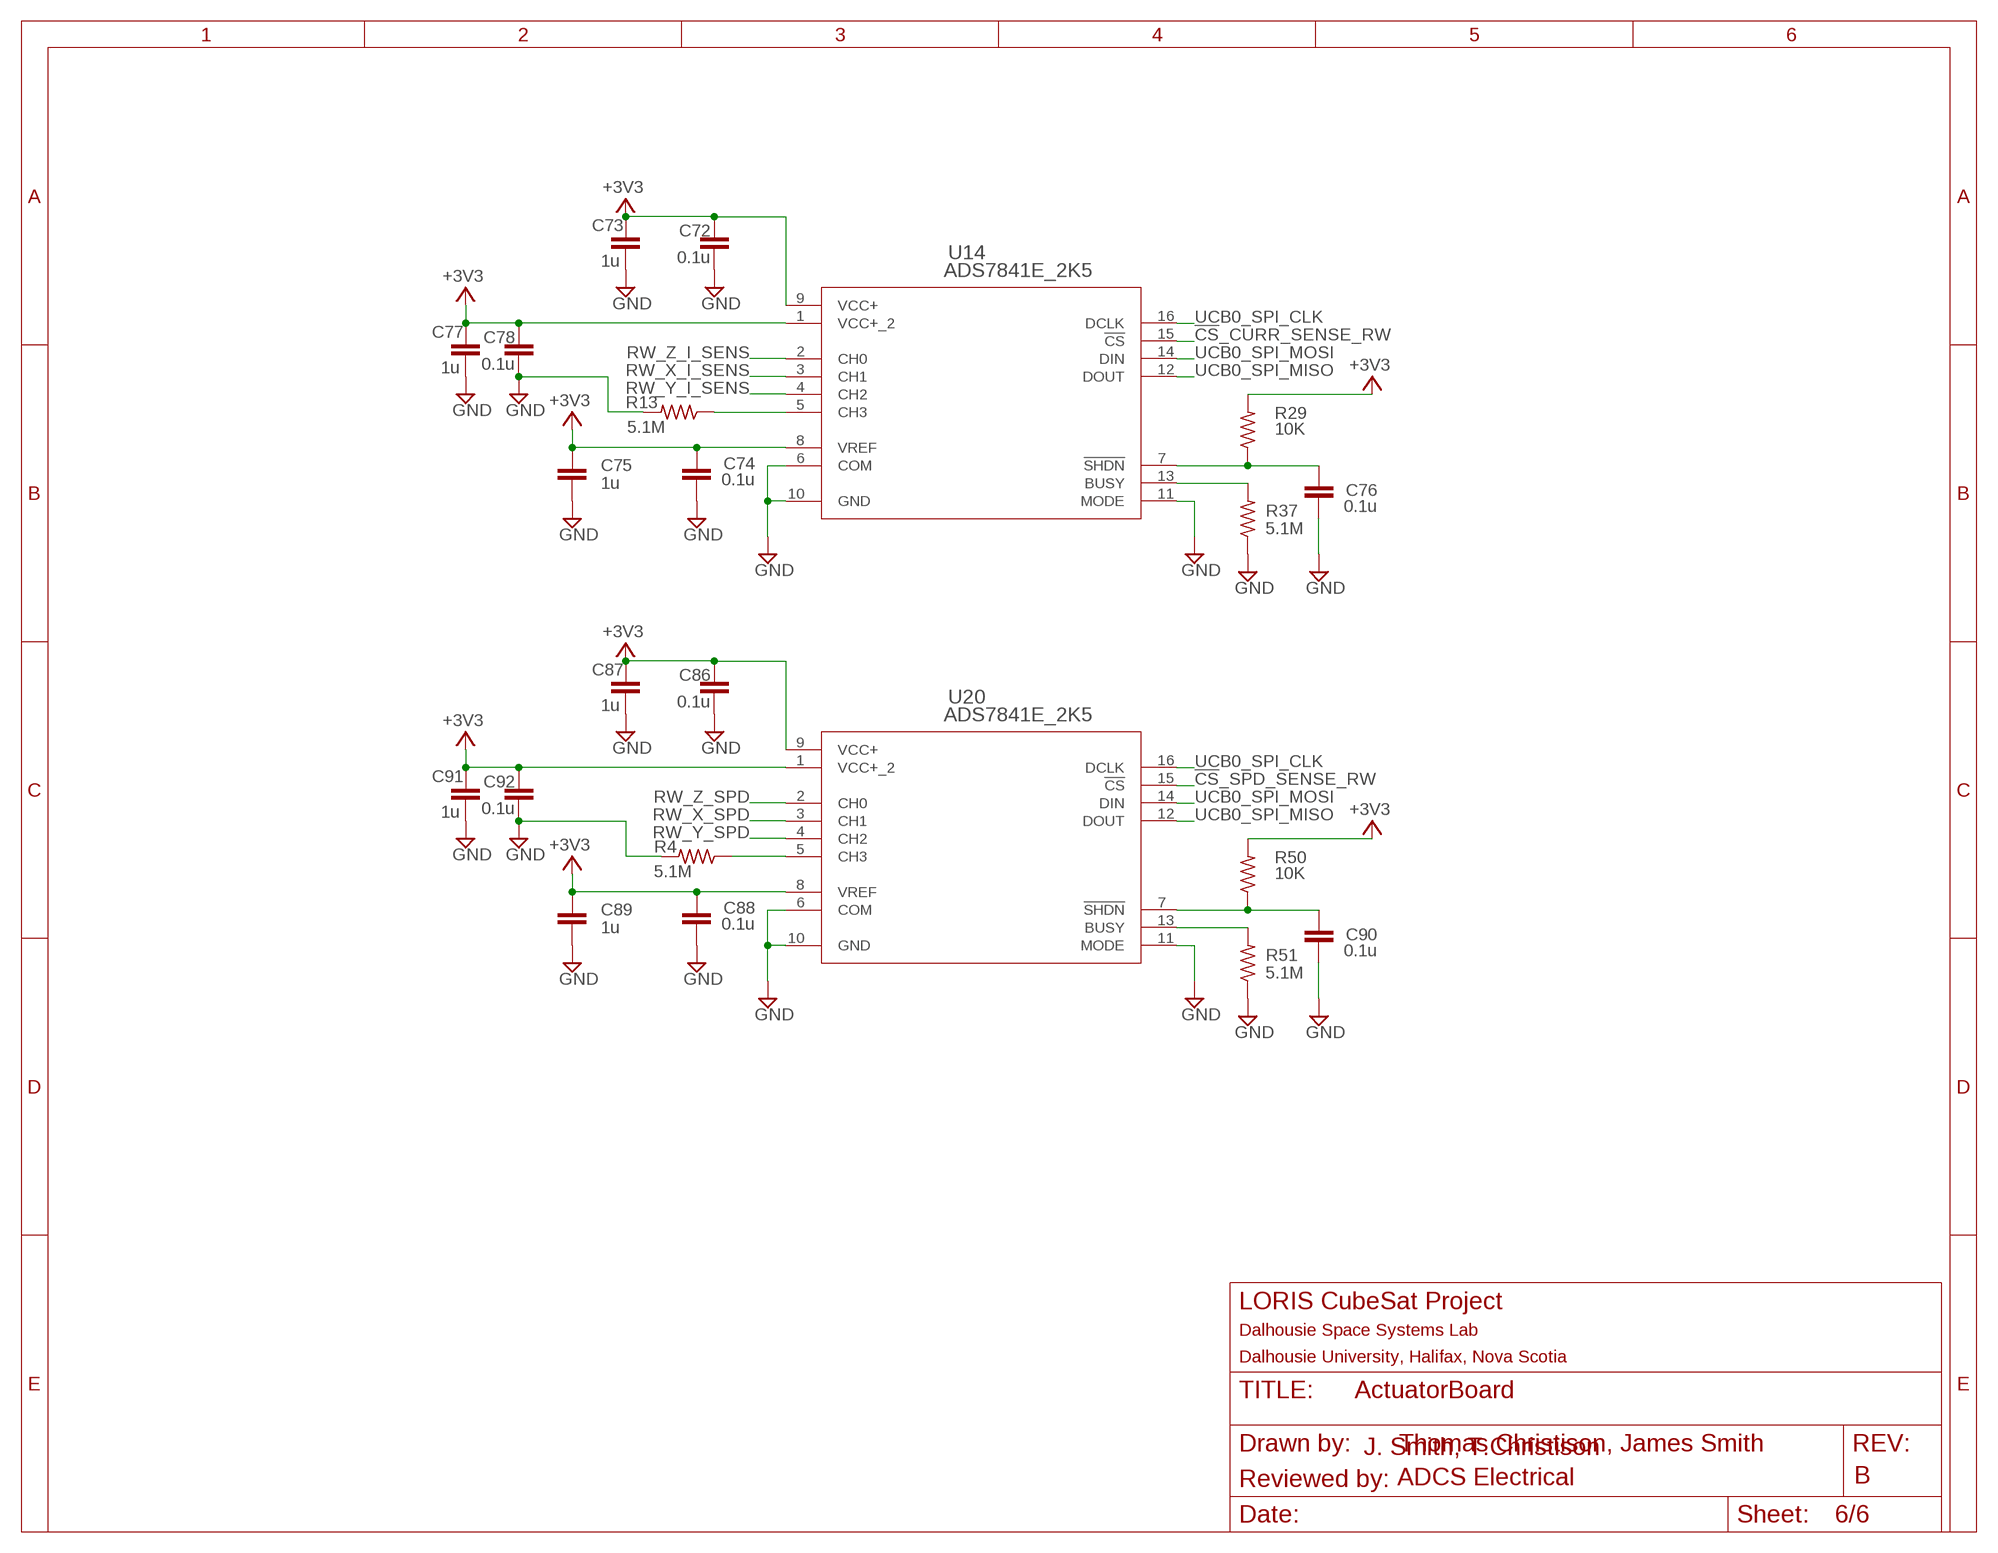
[diagram p5: schematic, sheet 6]

### Parts
C72  0.1u  C-EUC0402  [C0402]
C73  1u  C-EUC0402  [C0402]
C74  0.1u  C-EUC0402  [C0402]
C75  1u  C-EUC0402  [C0402]
C76  0.1u  C-EUC0402  [C0402]
C77  1u  C-EUC0402  [C0402]
C78  0.1u  C-EUC0402  [C0402]
C86  0.1u  C-EUC0402  [C0402]
C87  1u  C-EUC0402  [C0402]
C88  0.1u  C-EUC0402  [C0402]
C89  1u  C-EUC0402  [C0402]
C90  0.1u  C-EUC0402  [C0402]
C91  1u  C-EUC0402  [C0402]
C92  0.1u  C-EUC0402  [C0402]
R4  5.1M  R-US_R0402  [R0402]
R13  5.1M  R-US_R0402  [R0402]
R29  10K  R-US_R0402  [R0402]
R37  5.1M  R-US_R0402  [R0402]
R50  10K  R-US_R0402  [R0402]
R51  5.1M  R-US_R0402  [R0402]
U14  ADS7841E_2K5  [DBQ16]
U20  ADS7841E_2K5  [DBQ16]

### Nets
!CS!_CURR_SENSE_RW: U14.15(!CS) ; also sheet 2
!CS!_SPD_SENSE_RW: U20.15(!CS) ; also sheet 2
+3V3: C72.1 C73.1 C74.1 C75.1 C77.1 C78.1 C86.1 C87.1 C88.1 C89.1 C91.1 C92.1 R29.2 R50.2 U14.1(VCC+_2) U14.8(VREF) U14.9(VCC+) U20.1(VCC+_2) U20.8(VREF) U20.9(VCC+) ; also sheet 2,3,4,5
GND: C72.2 C73.2 C74.2 C75.2 C76.2 C77.2 C78.2 C86.2 C87.2 C88.2 C89.2 C90.2 C91.2 C92.2 R4.2 R13.2 R37.1 R51.1 U14.6(COM) U14.10(GND) U14.11(MODE) U20.6(COM) U20.10(GND) U20.11(MODE) ; also sheet 1,2,3,4,5
N$4: C76.1 R29.1 U14.7(!SHDN)
N$7: C90.1 R50.1 U20.7(!SHDN)
N$45: R37.2 U14.13(BUSY)
N$46: R13.1 U14.5(CH3)
N$59: R51.2 U20.13(BUSY)
N$60: R4.1 U20.5(CH3)
RW_X_I_SENS: U14.3(CH1) ; also sheet 3
RW_X_SPD: U20.3(CH1) ; also sheet 3
RW_Y_I_SENS: U14.4(CH2) ; also sheet 4
RW_Y_SPD: U20.4(CH2) ; also sheet 4
RW_Z_I_SENS: U14.2(CH0) ; also sheet 5
RW_Z_SPD: U20.2(CH0) ; also sheet 5
UCB0_SPI_CLK: U14.16(DCLK) U20.16(DCLK) ; also sheet 2
UCB0_SPI_MISO: U14.12(DOUT) U20.12(DOUT) ; also sheet 2
UCB0_SPI_MOSI: U14.14(DIN) U20.14(DIN) ; also sheet 2

### Notes on the sheet
- J. Smith, T.Christison
- ADCS Electrical | B

## Library data of the parts
C1-C4 C11-C16 C19 C20 C28 C30-C32 C34-C36 C38 C41 C42 C46 C52 C54 C55 C57-C63 C65-C78 C86-C92 = rcl:C-EU: CAPACITOR, European symbol; SPICEPREFIX: C
J1 J3 J6 J12 = my_library:PINHD-1X3: PIN HEADER
J2 J4 J11 = my_library:TE_1-84953-1
J5 = my_library:TE-1734829-3
JP1A JP1B = 832-10-012-10-005000:832-10-012-10-005000: Check prices <https://pricing.snapeda.com/parts/2355104-4/TE%20Connectivity/view-part?ref=eda>; AVAILABILITY: In Stock; COMMENT: 2355104-4; DESCRIPTION: Pin 4P,2MM,BRK HDR,SRVT,2.8,0.1AU,TB W/CAP 4 POS; MF: TE Connectivity; MP: 2355104-4; PACKAGE: None; PRICE: None; PURCHASE-URL: https://pricing.snapeda.com/search/part/2355104-4/?ref=eda
JP2 JP3 JP5 = pinhead:PINHD-1X2: PIN HEADER
MH5-MH8 = my_library:MTGP700H400
MX MY = my_library:NCTR-M002_MAGNETORQUER
R1-R25 R29-R37 R39-R44 R47-R51 R59-R72 R75 R77-R89 R102-R119 = rcl:R-US_: RESISTOR, American symbol; SPICEPREFIX: R
RWZ = my_library:REACTION_WHEEL_NOPINS_MAXON
TP2 TP4 TP5 TP8-TP30 TP33 TP34 TP37-TP40 TP47-TP53 TP55-TP63 = my_library:TESTPOINT
U1-U3 = my_library:SIP2100DY-T1-GE3
U6 U7 U16 = my_library:DRV10970_MOTOR_DRIVER
U8 U12 U19 = my_library:TSV991AILT: TVS991 General Purpose Op-Amp
U9 U14 U20 = my_library:ADS7841E_2K5; DATASHEET_URL: http://www.ti.com/lit/gpn/ADS7841; DESCRIPTION: 12-Bit, 4-Channel Serial Output Sampling Analog-to-Digital Converter; FAMILY_NAME: PRECISION ADC (<=10MSPS); GENERIC_PART_NUMBER: ADS7841; INDUSTRY_STD_PKG_TYPE: SSOP/QSOP; MANUFACTURER: Texas Instruments; PACKAGE_DESIGNATOR: DBQ; PIN_COUNT: 16
U10 U13 U17 = my_library:LM2917MX/NOPB